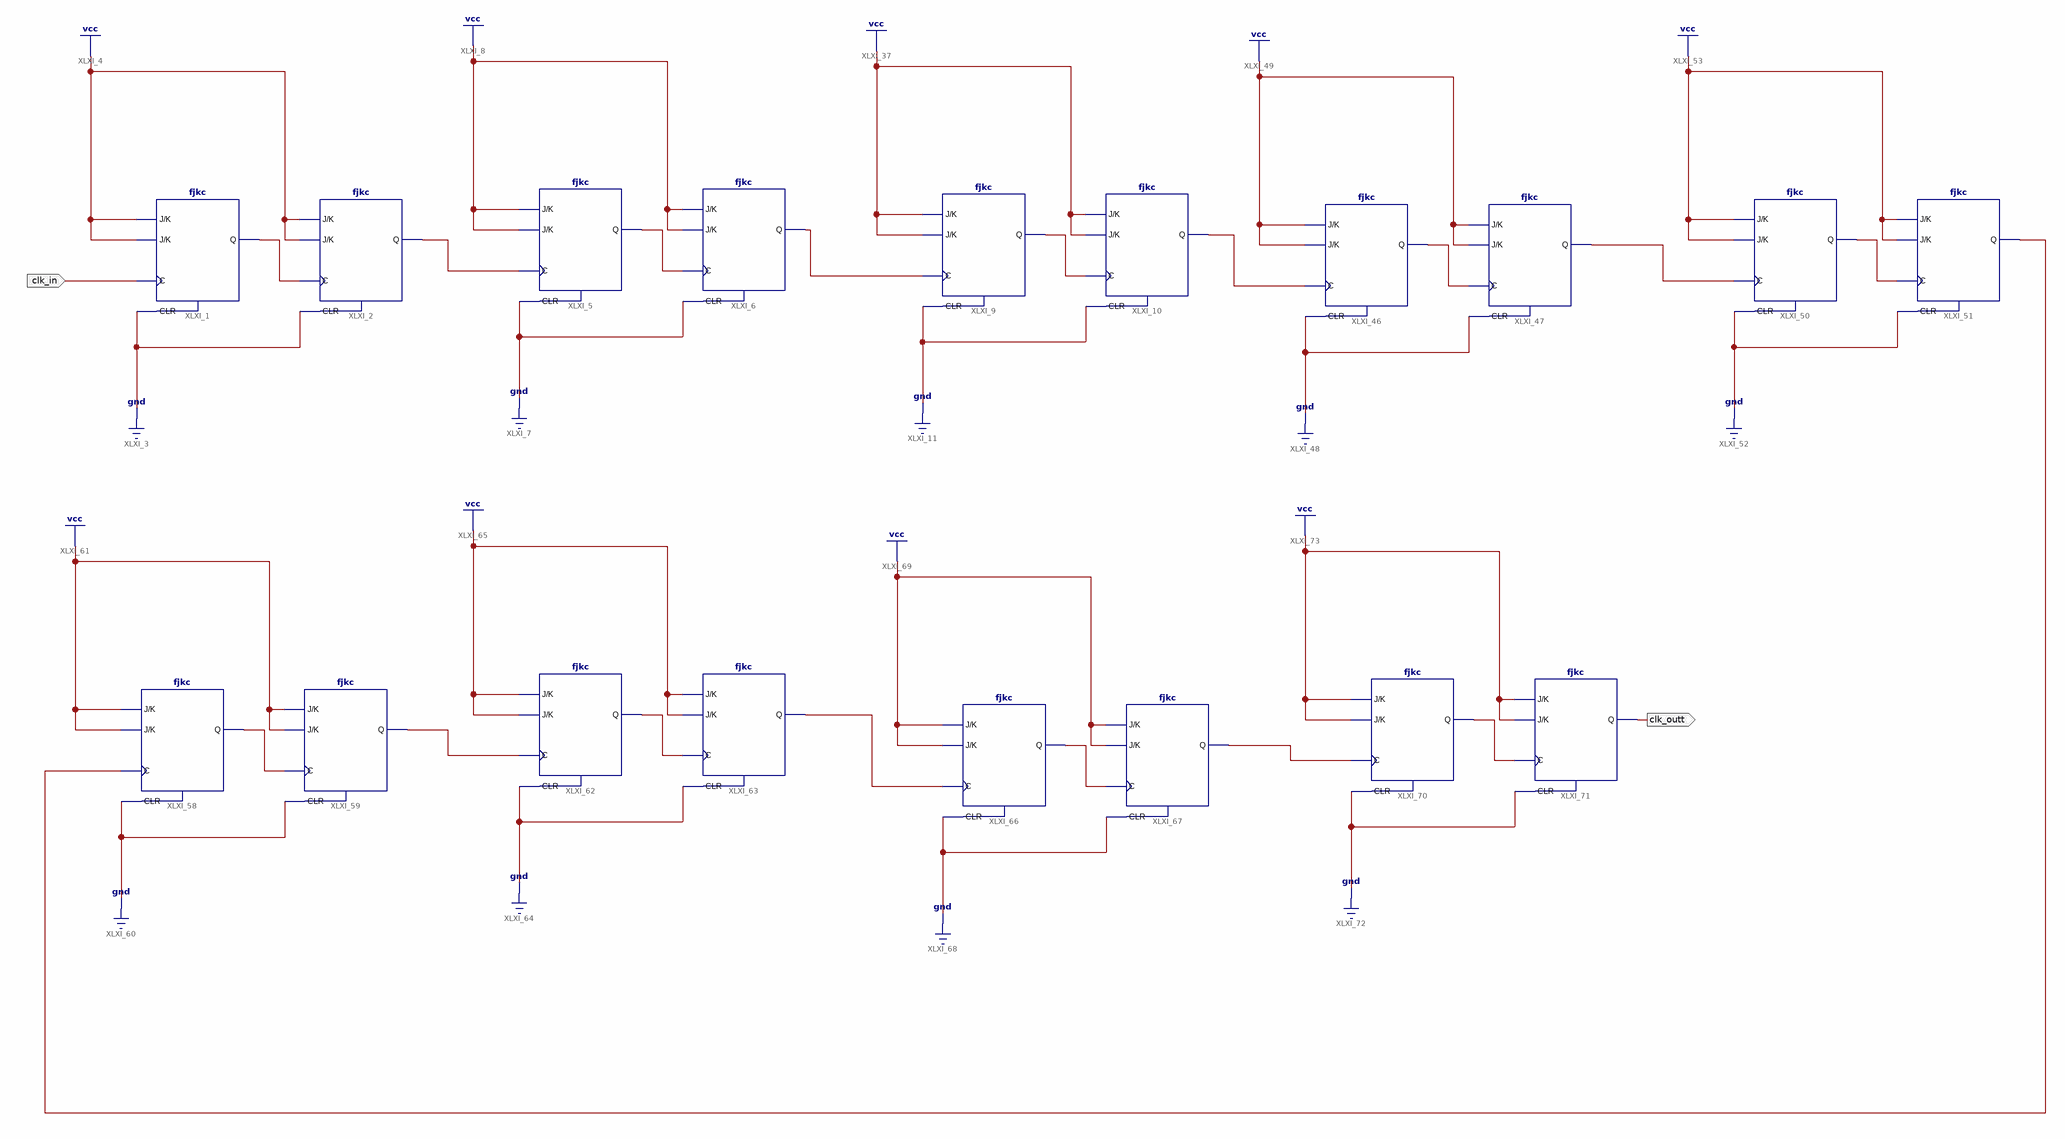
[diagram p0: schematic sheet 1]
// Xilinx ISE schematic clk218.sch (spartan6) as structural Verilog: 18 symbols, 2 ports
module clk218 (
  input  clk_in,
  output clk_outt
);

  wire clk_out, XLXN_3, XLXN_6, XLXN_49, XLXN_50, XLXN_62, XLXN_63, XLXN_66, XLXN_67, XLXN_74, XLXN_75,
       XLXN_78, XLXN_79, XLXN_82, XLXN_83, XLXN_87, XLXN_89;

  fjkc XLXI_1 (.C(clk_in), .CLR(1'b0), .J(1'b1), .K(1'b1), .Q(XLXN_3));
  fjkc XLXI_2 (.C(XLXN_3), .CLR(1'b0), .J(1'b1), .K(1'b1), .Q(clk_out));
  fjkc XLXI_5 (.C(clk_out), .CLR(1'b0), .J(1'b1), .K(1'b1), .Q(XLXN_6));
  fjkc XLXI_6 (.C(XLXN_6), .CLR(1'b0), .J(1'b1), .K(1'b1), .Q(XLXN_49));
  fjkc XLXI_9 (.C(XLXN_49), .CLR(1'b0), .J(1'b1), .K(1'b1), .Q(XLXN_50));
  fjkc XLXI_10 (.C(XLXN_50), .CLR(1'b0), .J(1'b1), .K(1'b1), .Q(XLXN_62));
  fjkc XLXI_46 (.C(XLXN_62), .CLR(1'b0), .J(1'b1), .K(1'b1), .Q(XLXN_63));
  fjkc XLXI_47 (.C(XLXN_63), .CLR(1'b0), .J(1'b1), .K(1'b1), .Q(XLXN_66));
  fjkc XLXI_50 (.C(XLXN_66), .CLR(1'b0), .J(1'b1), .K(1'b1), .Q(XLXN_67));
  fjkc XLXI_51 (.C(XLXN_67), .CLR(1'b0), .J(1'b1), .K(1'b1), .Q(XLXN_74));
  fjkc XLXI_58 (.C(XLXN_74), .CLR(1'b0), .J(1'b1), .K(1'b1), .Q(XLXN_75));
  fjkc XLXI_59 (.C(XLXN_75), .CLR(1'b0), .J(1'b1), .K(1'b1), .Q(XLXN_78));
  fjkc XLXI_62 (.C(XLXN_78), .CLR(1'b0), .J(1'b1), .K(1'b1), .Q(XLXN_79));
  fjkc XLXI_63 (.C(XLXN_79), .CLR(1'b0), .J(1'b1), .K(1'b1), .Q(XLXN_82));
  fjkc XLXI_66 (.C(XLXN_82), .CLR(1'b0), .J(1'b1), .K(1'b1), .Q(XLXN_83));
  fjkc XLXI_67 (.C(XLXN_83), .CLR(1'b0), .J(1'b1), .K(1'b1), .Q(XLXN_89));
  fjkc XLXI_70 (.C(XLXN_89), .CLR(1'b0), .J(1'b1), .K(1'b1), .Q(XLXN_87));
  fjkc XLXI_71 (.C(XLXN_87), .CLR(1'b0), .J(1'b1), .K(1'b1), .Q(clk_outt));
endmodule
